# Altium schematic sheet Peripherals.SchDoc: Peripherals
size A4; DocumentNumber: MB1165; Revision: C.1; SheetNumber: 12; SheetTotal: 17; Project: STM32469I-EVAL
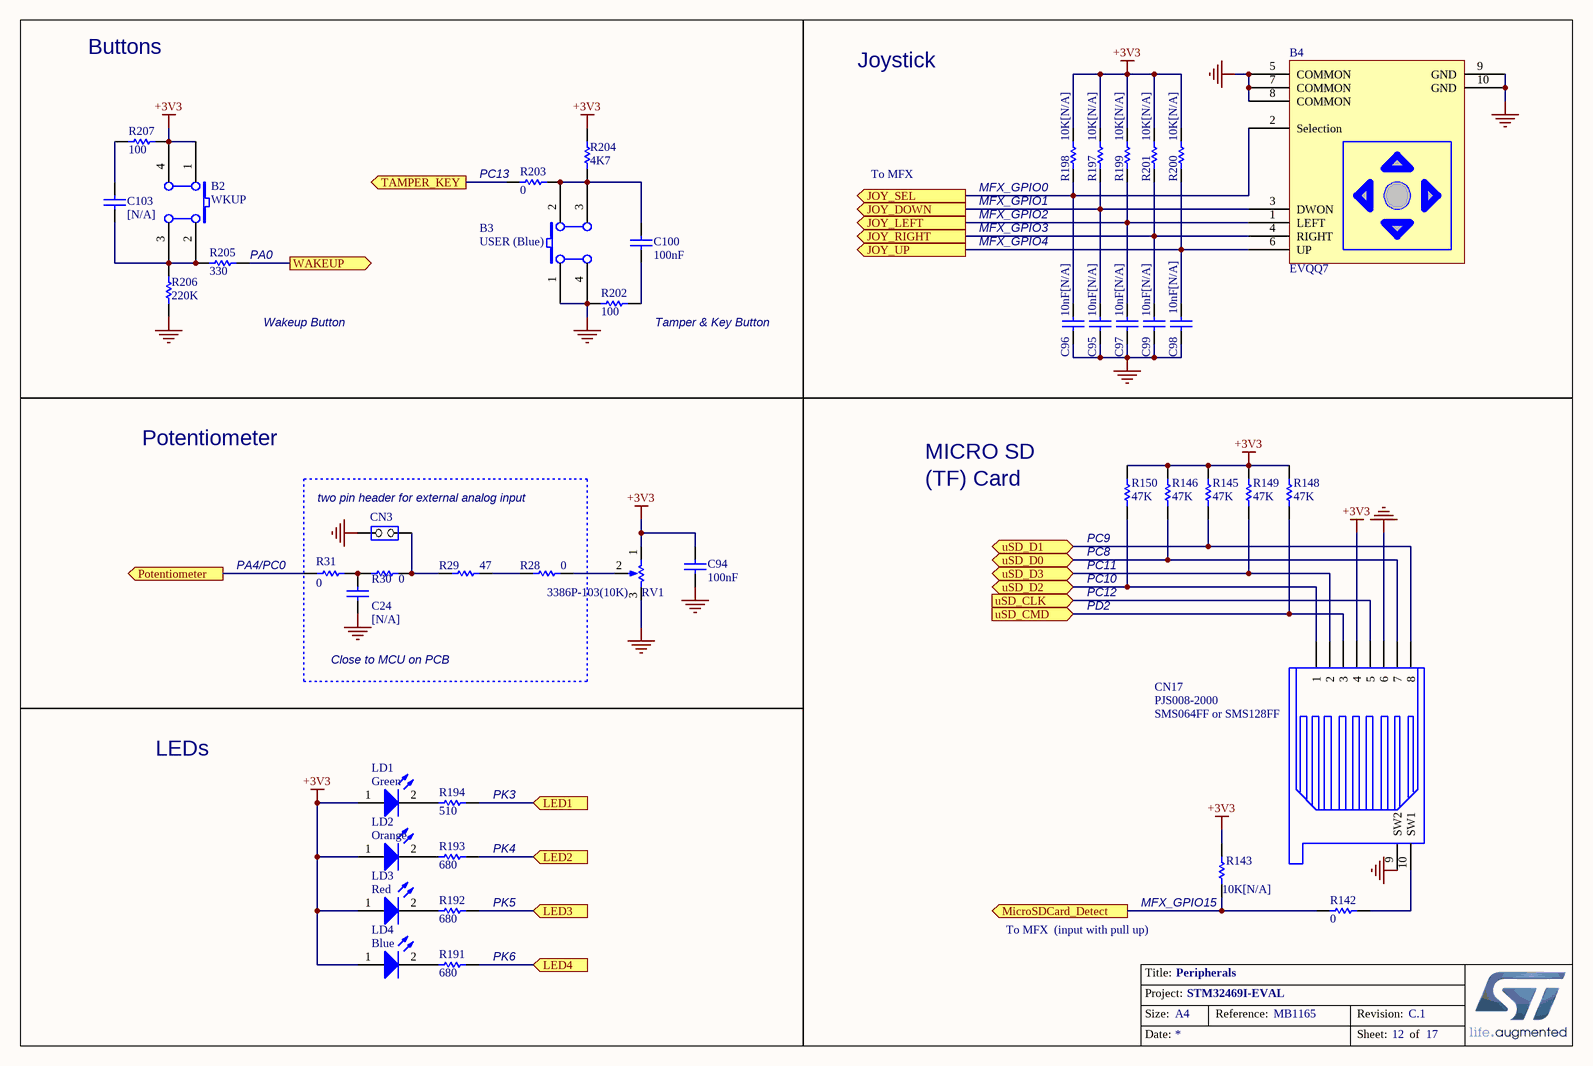
[diagram p0: Peripherals.SchDoc]

## Parts
B2  WKUP  [PB10]
B3  USER (Blue)  [PB10]
B4  EVQQ7  [SW-JOY]
C24  [N/A]  [0603C]
C94  100nF  [0603C]
C95  10nF[N/A]  [0603C]
C96  10nF[N/A]  [0603C]
C97  10nF[N/A]  [0603C]
C98  10nF[N/A]  [0603C]
C99  10nF[N/A]  [0603C]
C100  100nF  [0603C]
C103  [N/A]  [0603C]
CN3  (no value)  [SIP2]
CN17  PJS008-2000  [MSD_PJS008_]
LD1  Green  [0603D]
LD2  Orange  [0603D]
LD3  Red  [0603D]
LD4  Blue  [0603D]
R28  0  [0603R]
R29  47  [0603R]
R30  0  [0603R]
R31  0  [0603R]
R142  0  [0603R]
R143  10K[N/A]  [0603R]
R145  47K  [0603R]
R146  47K  [0603R]
R148  47K  [0603R]
R149  47K  [0603R]
R150  47K  [0603R]
R191  680  [0603R]
R192  680  [0603R]
R193  680  [0603R]
R194  510  [0603R]
R197  10K[N/A]  [0603R]
R198  10K[N/A]  [0603R]
R199  10K[N/A]  [0603R]
R200  10K[N/A]  [0603R]
R201  10K[N/A]  [0603R]
R202  100  [0603R]
R203  0  [0603R]
R204  4K7  [0603R]
R205  330  [0603R]
R206  220K  [0603R]
R207  100  [0603R]
RV1  3386P-103(10K)  [3386P]

## Ports
JOY_DOWN (out), JOY_LEFT (out), JOY_RIGHT (out), JOY_SEL (out), JOY_UP (out), LED1 (in), LED2 (in), LED3 (in), LED4 (in), MicroSDCard_Detect (out), Potentiometer (out), TAMPER_KEY (out), uSD_CLK (in), uSD_CMD (in), uSD_D0 (bidir), uSD_D1 (bidir), uSD_D2 (bidir), uSD_D3 (bidir), WAKEUP (out)

## Nets
+3V3: B2.1(A0) B2.4(A1) C94.1 CN17.4 LD1.1(A) LD2.1(A) LD3.1(A) LD4.1(A) R143.2 R145.1 R146.1 R148.1 R149.1 R150.1 R197.1 R198.1 R199.1 R200.1 R201.1 R204.2 R207.1 RV1.1(BOT)
GND: B3.1(A0) B3.4(A1) B4.5(COMMON) B4.7(COMMON) B4.8(COMMON) B4.9(GND) B4.10(GND) C24.1 C94.2 C95.1 C96.1 C97.1 C98.1 C99.1 CN3.2(NO) CN17.6 CN17.9(SW2) R202.1 R206.2 RV1.3(TOP)
JOY_DOWN: B4.3(DWON) C95.2 R197.2 ; port JOY_DOWN
JOY_LEFT: B4.1(LEFT) C97.2 R199.2 ; port JOY_LEFT
JOY_RIGHT: B4.4(RIGHT) C99.2 R201.2 ; port JOY_RIGHT
JOY_SEL: B4.2(Selection) C96.2 R198.2 ; port JOY_SEL
JOY_UP: B4.6(UP) C98.2 R200.2 ; port JOY_UP
LED1: R194.1 ; port LED1
LED2: R193.1 ; port LED2
LED3: R192.1 ; port LED3
LED4: R191.1 ; port LED4
MicroSDCard_Detect: R142.1 R143.1 ; port MicroSDCard_Detect
Potentiometer: R31.2 ; port Potentiometer
TAMPER_KEY: R203.2 ; port TAMPER_KEY
uSD_CLK: CN17.5 ; port uSD_CLK
uSD_CMD: CN17.3 R148.2 ; port uSD_CMD
uSD_D0: CN17.7 R146.2 ; port uSD_D0
uSD_D1: CN17.8 R145.2 ; port uSD_D1
uSD_D2: CN17.1 R150.2 ; port uSD_D2
uSD_D3: CN17.2 R149.2 ; port uSD_D3
WAKEUP: R205.2 ; port WAKEUP
NetB2_2: B2.2(B0) B2.3(B1) C103.2 R205.1 R206.1
NetB3_2: B3.2(B0) B3.3(B1) C100.2 R203.1 R204.1
NetC24_2: C24.2 R30.1 R31.1
NetC100_1: C100.1 R202.2
NetC103_1: C103.1 R207.2
NetCN3_1: CN3.1(COMMON) R29.1 R30.2
NetCN17_10: CN17.10(SW1) R142.2
NetLD1_2: LD1.2(K) R194.2
NetLD2_2: LD2.2(K) R193.2
NetLD3_2: LD3.2(K) R192.2
NetLD4_2: LD4.2(K) R191.2
NetR28_1: R28.1 R29.2
NetR28_2: R28.2 RV1.2(TAP)

## Notes on the sheet
- Buttons
- Joystick
- (near R203) PC13
- To MFX
- (near R198) MFX_GPIO0
- (near R205) PA0
- MFX_GPIO1
- MFX_GPIO2
- MFX_GPIO3
- MFX_GPIO4
- Wakeup Button
- (near R202) Tamper & Key Button
- Potentiometer
- MICRO SD
- (near CN3) two pin header for external analog input
- (TF) Card
- (near R31) PA4/PC0
- (near R150) PC8
- (near R150) PC9
- PC10
- PC11
- PC12
- Close to MCU on PCB
- PD2
- (near CN17) SMS064FF or SMS128FF
- LEDs
- (near R194) PK3
- (near R193) PK4
- (near R192) PK5
- To MFX  (input with pull up)
- (near R143) MFX_GPIO15
- (near R191) PK6
- Title:
- Project:
- Size:
- Date:
- A4
- Reference:
- Sheet:
- Revision:
- of

## Library data of the parts
B2 B3 = SW PUSHBUTTON: SE PUSHBUTTON
C24 = cap: Capacitor; Value: 100pF; Published: 8-Jun-2000; Revision: July-2002: Re-released for DXP Platform.; Publisher: Altium Limited
C94-C100 C103 = CAP: Capacitor; Value: 100pF; Published: 8-Jun-2000; Revision: July-2002: Re-released for DXP Platform.; Publisher: Altium Limited
CN3 = JP2
CN17 = SMS016AFA5E
LD1-LD4 = LED2: Typical RED, GREEN, YELLOW, AMBER GaAs LED; Published: 8-Jun-2000; Revision: July-2002: Re-released for DXP Platform.; Publisher: Altium Limited
R28-R31 R142 R143 R191-R194 R202 R203 R205 R207 = Res1: Resistor; Value: 1K; Published: 8-Jun-2000; Revision: July-2002: Re-released for DXP Platform.; Publisher: Altium Limited
R145 R146 R148-R150 R197-R201 R204 R206 = res1: Resistor; Value: 1K; Published: 8-Jun-2000; Revision: July-2002: Re-released for DXP Platform.; Publisher: Altium Limited
RV1 = RV